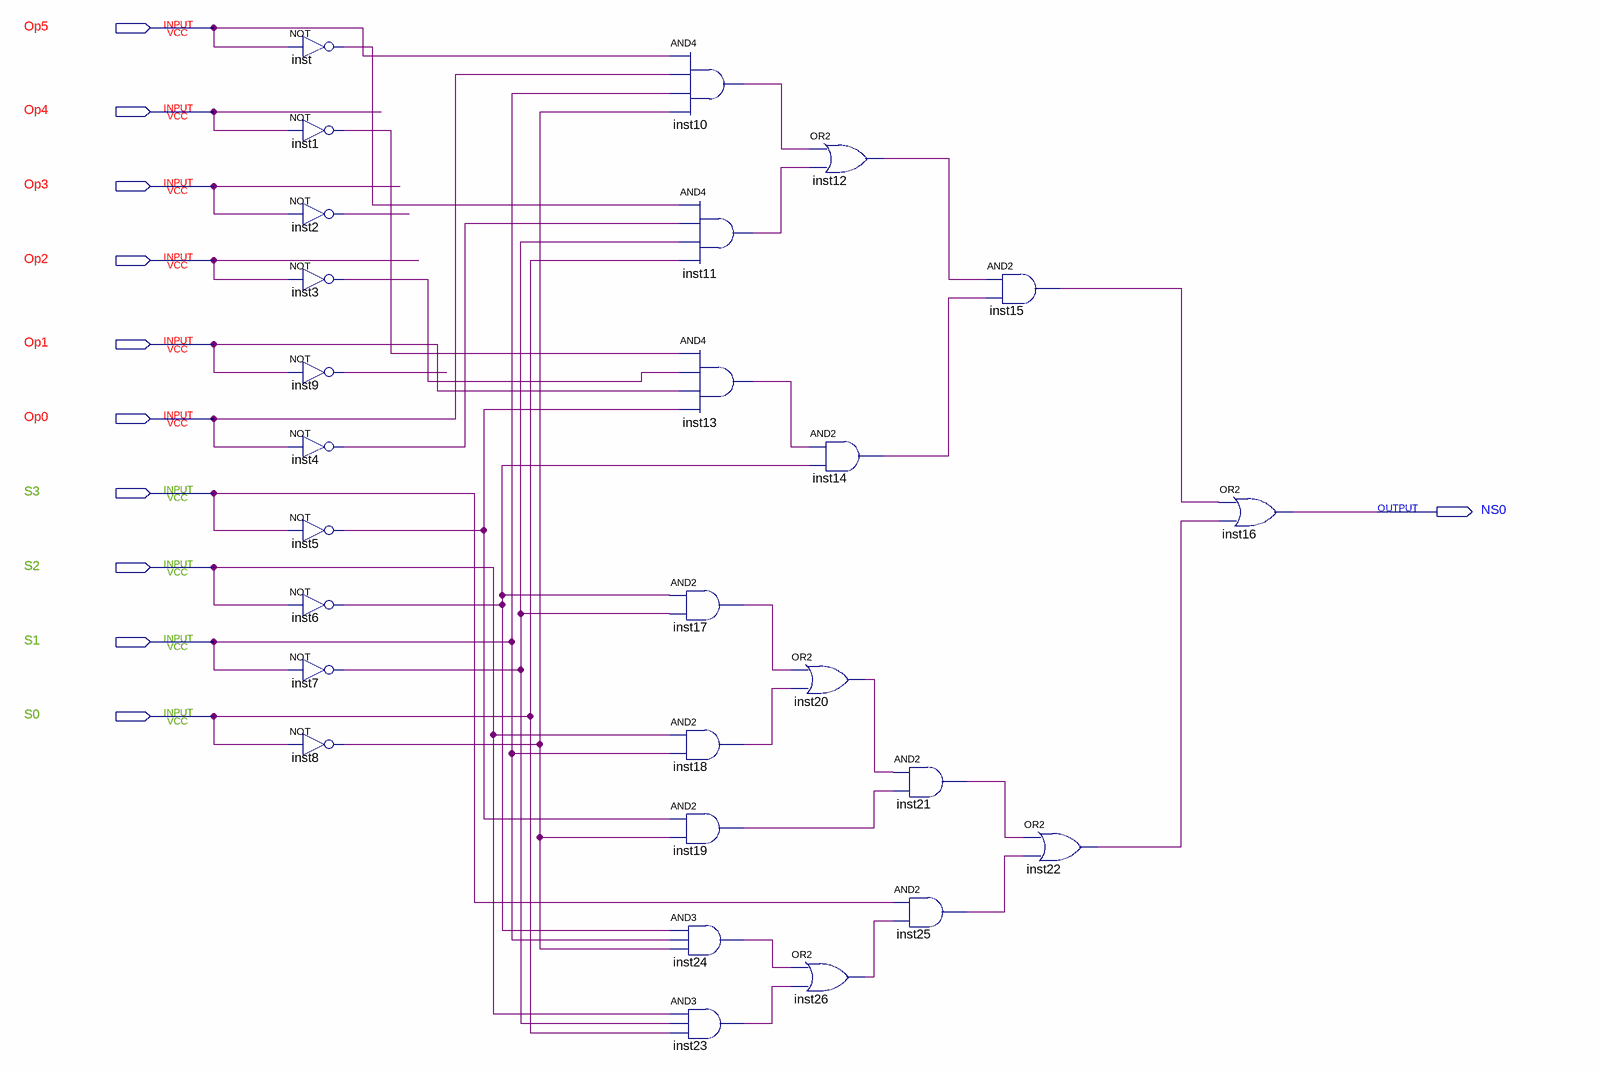
[diagram p0: schematic sheet]
// Quartus schematic NS0.bdf as structural Verilog: 27 symbols, 11 pins
module NS0 (
  input  Op5,
  input  Op4,
  input  Op3,
  input  Op2,
  input  Op1,
  input  Op0,
  input  S3,
  input  S2,
  input  S1,
  input  S0,
  output NS0
);

  wire inst1_out, inst2_out, inst3_out, inst4_out, inst5_out, inst6_out, inst7_out, inst8_out, inst9_out,
       inst10_out, inst11_out, inst12_out, inst13_out, inst14_out, inst15_out, inst17_out, inst18_out,
       inst19_out, inst20_out, inst21_out, inst22_out, inst23_out, inst24_out, inst25_out, inst26_out,
       inst_out;

  not inst (inst_out, Op5);
  not inst1 (inst1_out, Op4);
  not inst2 (inst2_out, Op3);
  not inst3 (inst3_out, Op2);
  not inst9 (inst9_out, Op1);
  not inst4 (inst4_out, Op0);
  not inst5 (inst5_out, S3);
  not inst6 (inst6_out, S2);
  not inst7 (inst7_out, S1);
  not inst8 (inst8_out, S0);
  and inst10 (inst10_out, Op5, Op0, S1, inst8_out);
  and inst11 (inst11_out, inst_out, inst4_out, inst7_out, S0);
  and inst13 (inst13_out, inst1_out, inst3_out, Op1, inst5_out);
  and inst17 (inst17_out, inst6_out, inst7_out);
  and inst18 (inst18_out, S2, S1);
  and inst19 (inst19_out, inst5_out, inst8_out);
  and inst24 (inst24_out, inst6_out, S1, inst8_out);
  and inst23 (inst23_out, S2, inst7_out, S0);
  or inst12 (inst12_out, inst10_out, inst11_out);
  and inst14 (inst14_out, inst13_out, inst6_out);
  or inst20 (inst20_out, inst17_out, inst18_out);
  or inst26 (inst26_out, inst24_out, inst23_out);
  and inst21 (inst21_out, inst20_out, inst19_out);
  and inst25 (inst25_out, S3, inst26_out);
  and inst15 (inst15_out, inst12_out, inst14_out);
  or inst22 (inst22_out, inst21_out, inst25_out);
  or inst16 (NS0, inst15_out, inst22_out);
endmodule
